# Altium schematic sheet io-headers.SchDoc
size A
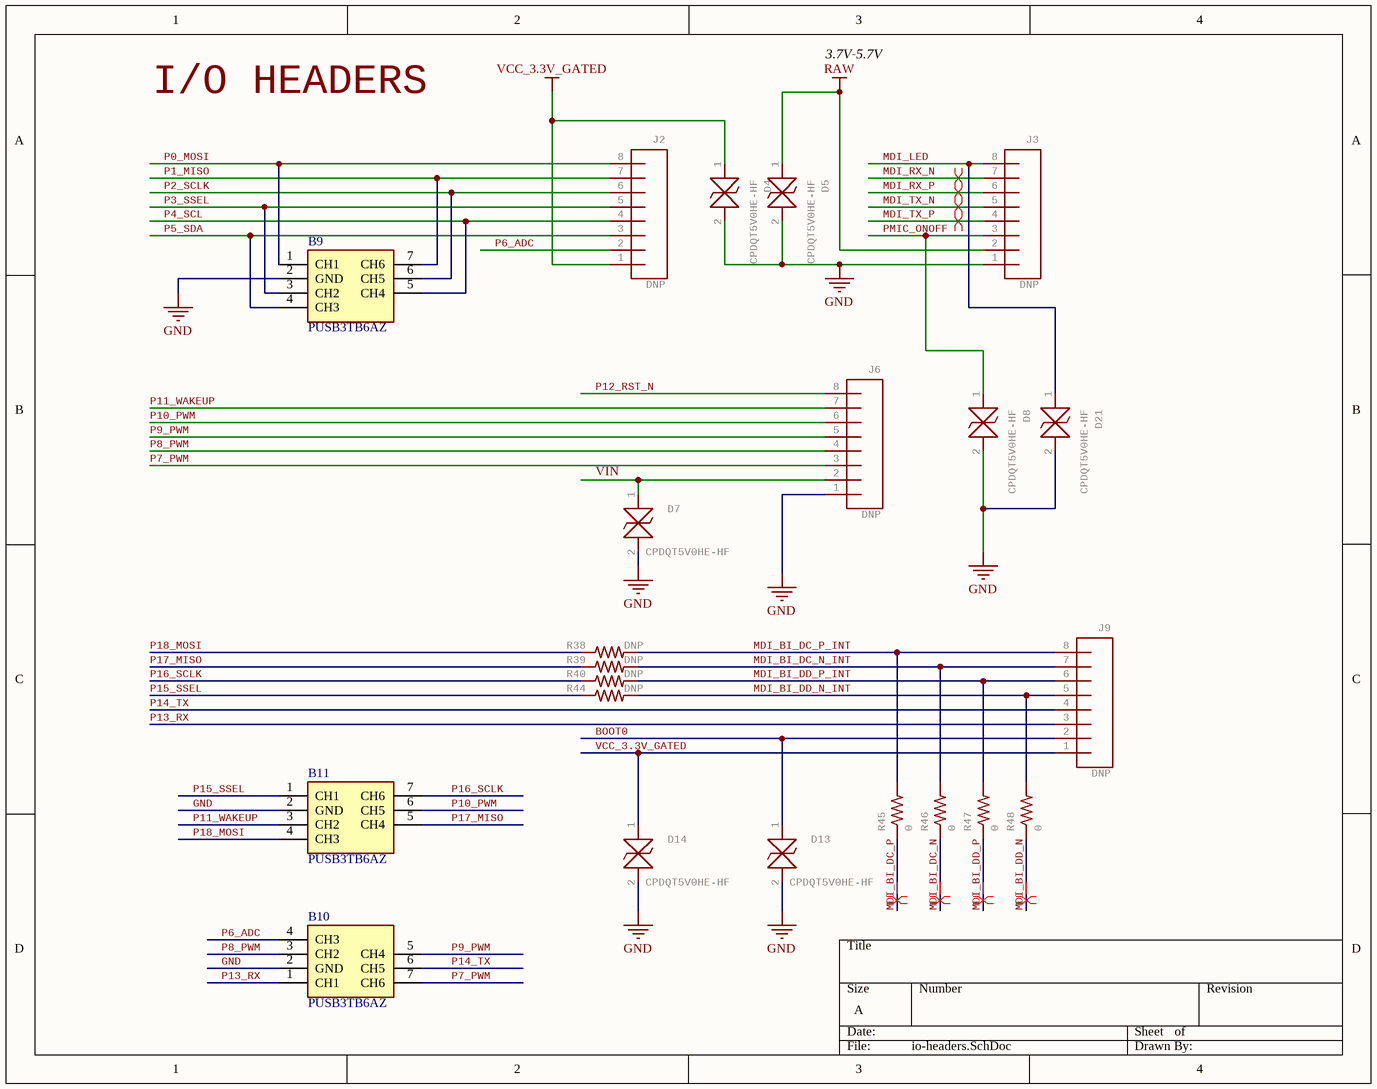
[diagram p0: io-headers.SchDoc]

## Parts
B9  PUSB3TB6AZ  [PUSB3TB6AZ]
B10  PUSB3TB6AZ  [PUSB3TB6AZ]
B11  PUSB3TB6AZ  [PUSB3TB6AZ]
D4  CPDQT5V0HE-HF  [CPDQT5V0HEHF]
D5  CPDQT5V0HE-HF  [CPDQT5V0HEHF]
D7  CPDQT5V0HE-HF  [CPDQT5V0HEHF]
D8  CPDQT5V0HE-HF  [CPDQT5V0HEHF]
D13  CPDQT5V0HE-HF  [CPDQT5V0HEHF]
D14  CPDQT5V0HE-HF  [CPDQT5V0HEHF]
D21  CPDQT5V0HE-HF  [CPDQT5V0HEHF]
J2  DNP  [1X08]
J3  DNP  [1X08]
J6  DNP  [1X08]
J9  DNP  [1X08]
R38  DNP  [0402-RES]
R39  DNP  [0402-RES]
R40  DNP  [0402-RES]
R44  DNP  [0402-RES]
R45  0  [0402-RES]
R46  0  [0402-RES]
R47  0  [0402-RES]
R48  0  [0402-RES]

## Nets
GND: B9.2(GND) B10.2(GND) B11.2(GND) D4.2 D5.2 D7.2 D8.2 D13.2 D14.2 D21.2 J3.1 J6.1
RAW: D5.1 J3.2
VCC_3.3V_GATED: D4.1 D14.1 J2.1 J9.1
BOOT0: D13.1 J9.2
MDI_BI_DC_N: R46.1
MDI_BI_DC_N_INT: J9.7 R39.2 R46.2
MDI_BI_DC_P: R45.1
MDI_BI_DC_P_INT: J9.8 R38.2 R45.2
MDI_BI_DD_N: R48.1
MDI_BI_DD_N_INT: J9.5 R44.2 R48.2
MDI_BI_DD_P: R47.1
MDI_BI_DD_P_INT: J9.6 R40.2 R47.2
MDI_LED: D21.1 J3.8
MDI_RX_N: J3.7
MDI_RX_P: J3.6
MDI_TX_N: J3.5
MDI_TX_P: J3.4
P0_MOSI: B9.1(CH1) J2.8
P1_MISO: B9.7(CH6) J2.7
P2_SCLK: B9.6(CH5) J2.6
P3_SSEL: B9.3(CH2) J2.5
P4_SCL: B9.5(CH4) J2.4
P5_SDA: B9.4(CH3) J2.3
P6_ADC: B10.4(CH3) J2.2
P7_PWM: B10.7(CH6) J6.3
P8_PWM: B10.3(CH2) J6.4
P9_PWM: B10.5(CH4) J6.5
P10_PWM: B11.6(CH5) J6.6
P11_WAKEUP: B11.3(CH2) J6.7
P12_RST_N: J6.8
P13_RX: B10.1(CH1) J9.3
P14_TX: B10.6(CH5) J9.4
P15_SSEL: B11.1(CH1) R44.1
P16_SCLK: B11.7(CH6) R40.1
P17_MISO: B11.5(CH4) R39.1
P18_MOSI: B11.4(CH3) R38.1
PMIC_ONOFF: D8.1 J3.3
VIN: D7.1 J6.2

## Layout directives
differential pair: MDI_BI_DC_N, MDI_BI_DC_P, MDI_BI_DD_N, MDI_BI_DD_P, MDI_RX_N, MDI_RX_P, MDI_TX_N, MDI_TX_P

## Notes on the sheet
- I/O HEADERS
- 3.7V-5.7V

## Library data of the parts
B9-B11 = PUSB3TB6AZ: NEXPERIA - PUSB3TB6AZ - DIODE, ESD PROTECTION, 5.5V, 0.27PF; Geometry.Height: 0.5mm; Mouser Part Number: 771-PUSB3TB6AZ; Mouser Price/Stock: https://www.mouser.co.uk/ProductDetail/Nexperia/PUSB3TB6AZ?qs=K2OaAKmNuLgsAI4MRas6Xw%3D%3D; Manufacturer_Name: Nexperia; Manufacturer_Part_Number: PUSB3TB6AZ; Datasheet Link: https://assets.nexperia.com/documents/data-sheet/PUSB3TB6.pdf; Part Number: PUSB3TB6AZ; MPN: PUSB3TB6AZ
D4 D5 D7 D8 D13 D14 D21 = CPDQT5V0HE-HF: ESD Suppressors / TVS Diodes DIODE ESD 5VWM 65W 0402/SOD-923F   Source:  Datasheet; MANUFACTURER_NAME: Comchip Technology; GateName_1: G$1; SymbolName_1: CPDQT5V0HE-HF; LibraryName: CPDQT5V0HE-HF; DeviceSetName: CPDQT5V0HE-HF; HEIGHT: 0.42mm; MANUFACTURER_PART_NUMBER: CPDQT5V0HE-HF; MOUSER_PART_NUMBER: MOUSER_PART_NUMBER; MOUSER_PRICE-STOCK: MOUSER_PRICE-STOCK; MPN: CPDQT5V0HE-HF; Part Number: CPDQT5V0HE-HF
J2 J3 J6 J9 = CONN_08": Multi connection point. Often used as Generic Header-pin footprint for 0.1 inch spaced/style header connections    On any of the 0.1 inch spaced packages, you can populate with these:  Break Away Headers - Straight (PRT-00116)   Break Away Male Headers - Right Angle (PRT-00553)   Female Headers (PRT-00115)   Break Away Headers - Machine Pin (PRT-00117)   Break Away Female Headers - Swiss Machine Pin (PRT-00743)   Arduino Stackable Header - 8 Pin (PRT-09279)        For SCREWTERMINALS and SPRING TERMINALS visit here:  Screw Terimnals on SparkFun.com (5mm/3.5mm/2.54mm spacing)       This device is also useful as a general connection point to wire up your design to another part of your project. Our various solder wires solder well into these plated through hole pads.  Hook-Up Wire - Assortment (Stranded, 22 AWG) (PRT-11375)   Hook-Up Wire - Assortment (Solid Core, 22 AWG) (PRT-11367)   View the entire wire category on our website here          Special notes:     Molex polarized connector foot print use with SKU : PRT-08231 with associated crimp pins and housings. 1MM SMD Version SKU: PRT-10208    NOTES ON THE VARIANTS LOCK and LOCK_LONGPADS... This footprint was designed to help hold the alignment of a through-hole component (i.e.  6-pin header) while soldering it into place. You may notice that each hole has been shifted either up or down by 0.005 of an inch from it's more standard position (which is a perfectly straight line).  This slight alteration caused the pins (the squares in the middle) to touch the edges of the holes.  Because they are alternating, it causes a "brace" to hold the component in place.  0.005 has proven to be the perfect amount of "off-center" position when using our standard breakaway headers. Although looks a little odd when you look at the bare footprint, once you have a header in there, the alteration is very hard to notice.  Also,if you push a header all the way into place, it is covered up entirely on the bottom side.; GateName_1: G$1; DeviceName: "; POPULATE: 0; PROD_ID: CONN-08438; SymbolName_1: CONN_08; LibraryName: SparkFun-Connectors; DeviceSetName: CONN_08; MPN: DNP; Part Number: DNP
R38-R40 R44 = RESISTOR0402-RES: ResistorBasic schematic elements and footprints for 0603, 1206, and PTH resistors.; GateName_1: G$1; SymbolName_1: RESISTOR; DeviceName: 0402-RES; LibraryName: sfe; DeviceSetName: RESISTOR; MPN: DNP; Part Number: DNP
R45-R48 = RESISTOR0402-RES: ResistorBasic schematic elements and footprints for 0603, 1206, and PTH resistors.; MPN: RC0402JR-070R; GateName_1: G$1; SymbolName_1: RESISTOR; DeviceName: 0402-RES; LibraryName: sfe; DeviceSetName: RESISTOR; Part Number: RC0402JR-070R